# Altium schematic sheet USB2-HUB.SchDoc
size 297 x 209 mm; DocumentNumber: 5; SheetNumber: 5
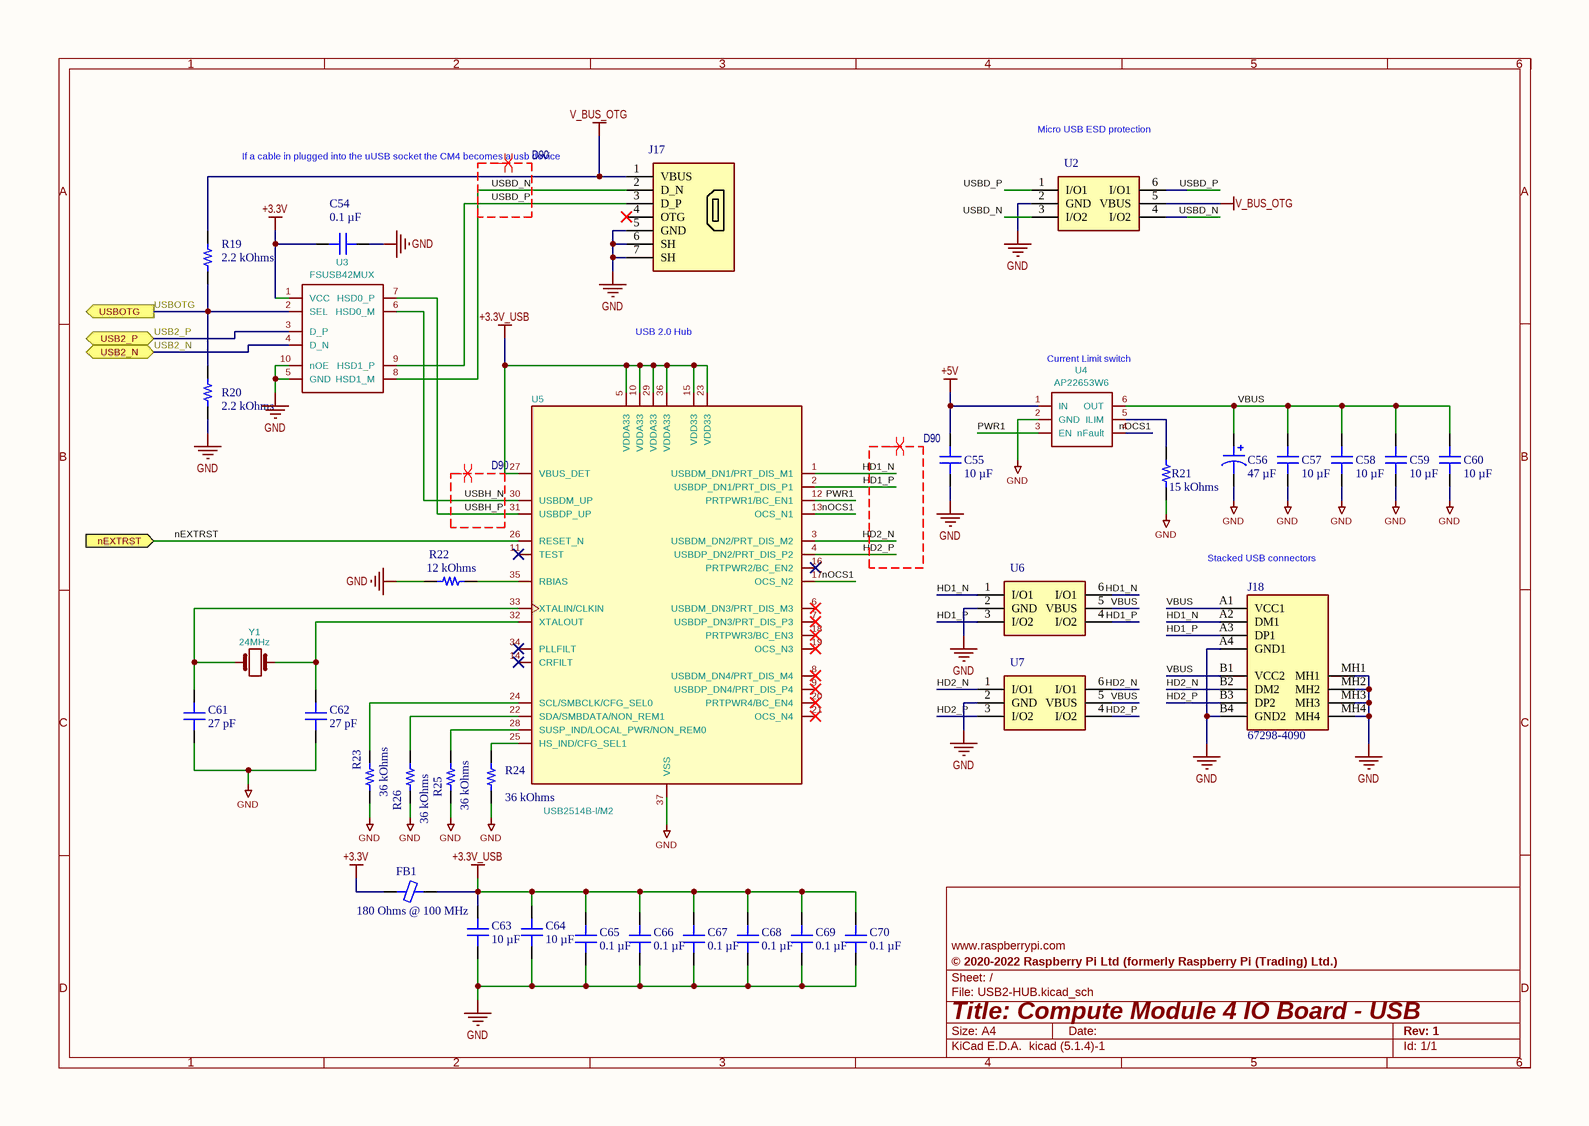
[diagram p0: USB2-HUB.SchDoc]

## Parts
C54  0.1 µF  [CAP 0603_1608]
C55  10 µF  [CAP 0805_2012]
C56  47 µF  [CAP POL 2917_7343]
C57  10 µF  [CAP 0805_2012]
C58  10 µF  [CAP 0805_2012]
C59  10 µF  [CAP 0805_2012]
C60  10 µF  [CAP 0805_2012]
C61  27 pF  [CAP 0603_1608]
C62  27 pF  [CAP 0603_1608]
C63  10 µF  [CAP 0805_2012]
C64  10 µF  [CAP 0805_2012]
C65  0.1 µF  [CAP 0603_1608]
C66  0.1 µF  [CAP 0603_1608]
C67  0.1 µF  [CAP 0603_1608]
C68  0.1 µF  [CAP 0603_1608]
C69  0.1 µF  [CAP 0603_1608]
C70  0.1 µF  [CAP 0603_1608]
FB1  180 Ohms @ 100 MHz  [FER 0603_1608]
J17  KLS1-2233B-B  [KLS1-2233B]  (value not drawn)
J18  67298-4090  [672984090]
R19  2.2 kOhms  [YAGEO RES 0603_1608]
R20  2.2 kOhms  [YAGEO RES 0603_1608]
R21  15 kOhms  [YAGEO RES 0603_1608]
R22  12 kOhms  [YAGEO RES 0603_1608]
R23  36 kOhms  [YAGEO RES 0603_1608]
R24  36 kOhms  [YAGEO RES 0603_1608]
R25  36 kOhms  [YAGEO RES 0603_1608]
R26  36 kOhms  [YAGEO RES 0603_1608]
U2  USBLC6-2SC6  [SOT95P280X145-6N]  (value not drawn)
U3  FSUSB42MUX  [MSOP-10_3x3mm_P0.5mm]
U4  AP22653W6  [SOT-23-6]
U5  USB2514B-I/M2  [QFN-36-1EP_6x6mm_P0.5mm_EP3.7x3.7mm]
U6  USBLC6-2SC6  [SOT95P280X145-6N]  (value not drawn)
U7  USBLC6-2SC6  [SOT95P280X145-6N]  (value not drawn)
Y1  24MHz  [Crystal_SMD_HC49-SD]

## Ports
nEXTRST (in, see GrandMini_v1[8B], CM4_GPIO[2C]), USB2_N (bidir, see GrandMini_v1[7B], CM4_HighSpeed[2A]), USB2_P (bidir, see GrandMini_v1[7B], CM4_HighSpeed[2A]), USBOTG (out, see GrandMini_v1[7B])

## Nets
+3.3V: C54.2 FB1.2 U3.1(VCC)
+3.3V_USB: C63.2 C64.2 C65.2 C66.2 C67.2 C68.2 C69.2 C70.2 FB1.1 U5.5(VDDA33) U5.10(VDDA33) U5.15(VDD33) U5.23(VDD33) U5.27(VBUS_DET) U5.29(VDDA33) U5.36(VDDA33)
+5V: C55.2 U4.1(IN)
GND: C54.1 C55.1 C56.2 C57.1 C58.1 C59.1 C60.1 C61.1 C62.1 C63.1 C64.1 C65.1 C66.1 C67.1 C68.1 C69.1 C70.1 J17.5(GND) J17.6(SH) J17.7(SH) J18.A4(GND1) J18.B4(GND2) J18.MH1 J18.MH2 J18.MH3 J18.MH4 R20.1 R21.1 R22.2 R23.2 R24.2 R25.2 R26.2 U2.2(GND) U3.5(GND) U3.10(nOE) U4.2(GND) U5.37(VSS) U6.2(GND) U7.2(GND)
V_BUS_OTG: J17.1(VBUS) R19.2 U2.5(VBUS)
HD1_N: J18.A2(DM1) U5.1(USBDM_DN1/PRT_DIS_M1) U6.1(I/O1) U6.6(I/O1)
HD1_P: J18.A3(DP1) U5.2(USBDP_DN1/PRT_DIS_P1) U6.3(I/O2) U6.4(I/O2)
HD2_N: J18.B2(DM2) U5.3(USBDM_DN2/PRT_DIS_M2) U7.1(I/O1) U7.6(I/O1)
HD2_P: J18.B3(DP2) U5.4(USBDP_DN2/PRT_DIS_P2) U7.3(I/O2) U7.4(I/O2)
nEXTRST: U5.26(RESET_N) ; port nEXTRST
nOCS1: U4.4(nFault) U5.13(OCS_N1) U5.17(OCS_N2)
PWR1: U4.3(EN) U5.12(PRTPWR1/BC_EN1)
USB2_N: U3.4(D_N) ; port USB2_N
USB2_P: U3.3(D_P) ; port USB2_P
USBD_N: J17.2(D_N) U2.3(I/O2) U2.4(I/O2) U3.8(HSD1_M)
USBD_P: J17.3(D_P) U2.1(I/O1) U2.6(I/O1) U3.9(HSD1_P)
USBH_N: U3.6(HSD0_M) U5.30(USBDM_UP)
USBH_P: U3.7(HSD0_P) U5.31(USBDP_UP)
USBOTG: R19.1 R20.2 U3.2(SEL) ; port USBOTG
VBUS: C56.1 C57.2 C58.2 C59.2 C60.2 J18.A1(VCC1) J18.B1(VCC2) U4.6(OUT) U6.5(VBUS) U7.5(VBUS)
NetC61_2: C61.2 U5.33(XTALIN/CLKIN) Y1.1
NetC62_2: C62.2 U5.32(XTALOUT) Y1.2
NetR21_2: R21.2 U4.5(ILIM)
NetR22_1: R22.1 U5.35(RBIAS)
NetR23_1: R23.1 U5.24(SCL/SMBCLK/CFG_SEL0)
NetR24_1: R24.1 U5.25(HS_IND/CFG_SEL1)
NetR25_1: R25.1 U5.28(SUSP_IND/LOCAL_PWR/NON_REM0)
NetR26_1: R26.1 U5.22(SDA/SMBDATA/NON_REM1)

Not connected (* = marked no-connect by the designer): J17 4(OTG)*; U5 6(USBDM_DN3/PRT_DIS_M3)* 7(USBDP_DN3/PRT_DIS_P3)* 8(USBDM_DN4/PRT_DIS_M4)* 9(USBDP_DN4/PRT_DIS_P4)* 11(TEST)* 14(CRFILT)* 16(PRTPWR2/BC_EN2)* 18(PRTPWR3/BC_EN3)* 19(OCS_N3)* 20(PRTPWR4/BC_EN4)* 21(OCS_N4)* 34(PLLFILT)*

## Layout directives
differential pair; differential pair class D90: HD1_N, HD1_P, HD2_N, HD2_P, USBD_N, USBD_P, USBH_N, USBH_P

## Notes on the sheet
- Micro USB ESD protection
- If a cable in plugged into the uUSB socket the CM4 becomes a usb device
- USB 2.0 Hub
- (near U4) Current Limit switch
- (near J18) Stacked USB connectors
- 1
- 2
- 3
- 4
- 5
- 6
- A
- B
- C
- www.raspberrypi.com <http://www.raspberrypi.com>
- D
- Title: Compute Module 4 IO Board - USB
- File: USB2-HUB.kicad_sch
- Sheet: /
- © 2020-2022 Raspberry Pi Ltd (formerly Raspberry Pi (Trading) Ltd.)
- KiCad E.D.A.  kicad (5.1.4)-1
- Size: A4
- Date:
- Rev: 1
- Id: 1/1

## Library data of the parts
C54 C65-C70 = CC0603KRX7R9BB104: CAP CER 0.1UF 50V X7R 0603; manufacturer: Yageo; Tolerance: ±10%; Value: 0.1 µF; Part Number: CC0603KRX7R9BB104; Applications: General Purpose; Capacitance: 0.1 µF; componentlink1description: Datasheet; componentlink1url: https://www.yageo.com/upload/media/product/productsearch/datasheet/mlcc/UPY-GPHC_X7R_6.3V-to-50V_18.pdf; componentlink2description: DigiKey Link; componentlink2url: https://www.digikey.com/en/products/detail/yageo/CC0603KRX7R9BB104/2103082; Device Package: 0603 (1608 Metric); lastupdated: 09.02.2024 20:10:21; Lifecycle Status: Active; Minimum Order: 1; Mounting Type: Surface Mount, MLCC; Operating Temperature: -55°C ~ 125°C; Package / Case: 0603 (1608 Metric); packaging: TapeAndReel; partid: 9506; Part Status: Active; price: 0.01; series: CC; Size / Dimension: 0.063" L x 0.031" W (1.60mm x 0.80mm); Supplier 1: DigiKey; Supplier Part Number 1: 311-1344-1-ND; Temperature Coefficient: X7R; Thickness (Max): 0.035" (0.90mm); Voltage - Rated: 50V
C55 C57-C60 C63 C64 = CC0805KKX5R8BB106: CAP CER 10UF 25V X5R 0805; manufacturer: Yageo; Tolerance: ±10%; Value: 10 µF; Part Number: CC0805KKX5R8BB106; Applications: General Purpose; Capacitance: 10 µF; componentlink1description: Datasheet; componentlink1url: https://www.yageo.com/upload/media/product/productsearch/datasheet/mlcc/UPY-GPHC_X5R_4V-to-50V_25.pdf; componentlink2description: DigiKey Link; componentlink2url: https://www.digikey.com/en/products/detail/yageo/CC0805KKX5R8BB106/5195275; Device Package: 0805 (2012 Metric); lastupdated: 09.02.2024 20:15:28; Lifecycle Status: Active; Minimum Order: 1; Mounting Type: Surface Mount, MLCC; Operating Temperature: -55°C ~ 85°C; Package / Case: 0805 (2012 Metric); packaging: TapeAndReel; partid: 16151; Part Status: Active; price: 0.06; series: CC; Size / Dimension: 0.079" L x 0.049" W (2.00mm x 1.25mm); Supplier 1: DigiKey; Supplier Part Number 1: 311-1869-1-ND; Temperature Coefficient: X5R; Thickness (Max): 0.057" (1.45mm); Voltage - Rated: 25V
C56 = T491X476K035AT: CAP TANT 47UF 10% 35V 2917; manufacturer: KEMET; Manufacturer Size Code: X; ESR (Equivalent Series Resistance): 600mOhm; Lifetime @ Temp.: 2000 Hrs @ 125°C; Type: Molded; Value: 47 µF; Part Number: T491X476K035AT; Capacitance: 47 µF; componentlink1description: Datasheet; componentlink1url: https://api.kemet.com/component-edge/download/datasheet/T491X476K035AT.pdf; componentlink2description: DigiKey Link; componentlink2url: https://www.digikey.com/en/products/detail/kemet/T491X476K035AT/818681; Device Package: 2917 (7343 Metric); Features: General Purpose; Height - Seated (Max): 0.169" (4.30mm); lastupdated: 03.06.2024 19:30:20; Lifecycle Status: Active; Minimum Order: 1; Mounting Type: Surface Mount; Operating Temperature: -55°C ~ 125°C; Package / Case: 2917 (7343 Metric); packaging: TapeAndReel; partid: 3168; Part Status: Active; price: 1.10; series: T491; Size / Dimension: 0.287" L x 0.169" W (7.30mm x 4.30mm); Supplier 1: DigiKey; Supplier Part Number 1: 399-3821-1-ND; Tolerance: ±10%; Voltage - Rated: 35 V
C61 C62 = CC0603GRNPO0BN270: CAP CER 27PF 100V C0G/NPO 0603; manufacturer: Yageo; Temperature Coefficient: C0G, NP0; Tolerance: ±2%; Value: 27 pF; Part Number: CC0603GRNPO0BN270; Applications: General Purpose; Capacitance: 27 pF; componentlink1description: Datasheet; componentlink1url: //media.digikey.com/pdf/Data%20Sheets/Yageo%20PDFs/CCseries_mlcc_2002.pdf; componentlink2description: DigiKey Link; componentlink2url: https://www.digikey.com/en/products/detail/yageo/CC0603GRNPO0BN270/5883527; Device Package: 0603 (1608 Metric); lastupdated: 09.02.2024 20:10:23; Lifecycle Status: Active; Minimum Order: 1; Mounting Type: Surface Mount, MLCC; Operating Temperature: -55°C ~ 125°C; Package / Case: 0603 (1608 Metric); packaging: TapeAndReel; partid: 39171; Part Status: Active; price: 0.01; series: CC; Size / Dimension: 0.063" L x 0.031" W (1.60mm x 0.80mm); Supplier 1: DigiKey; Supplier Part Number 1: 311-3910-1-ND; Thickness (Max): 0.035" (0.90mm); Voltage - Rated: 100V
FB1 = BLM18PG181SN1D: FERRITE BEAD 180 OHM 0603 1LN; Manufacturer: Murata Electronics; Current Rating (Max): 1.5A; DC Resistance (DCR) (Max): 90mOhm; Filter Type: Power Line; Number of Lines: 1; Part Number: BLM18PG181SN1D; ComponentLink1Description: Datasheet; ComponentLink1URL: https://www.murata.com/en-us/products/productdata/8796738650142/ENFA0003.pdf; ComponentLink2Description: DigiKey Link; ComponentLink2URL: https://www.digikey.com/en/products/detail/murata-electronics/BLM18PG181SN1D/1634634; Device Package: 0603 (1608 Metric); Height (Max): 0.037" (0.95mm); Impedance @ Frequency: 180 Ohms @ 100 MHz; LastUpdated: 03.06.2024 19:51:52; Lifecycle Status: Active; Minimum Order: 1; Mounting Type: Surface Mount; Operating Temperature: -55°C ~ 125°C; Package / Case: 0603 (1608 Metric); Packaging: TapeAndReel; PartId: 858; Part Status: Active; Price: 0.02; Series: EMIFIL®, BLM18; Size / Dimension: 0.063" L x 0.032" W (1.60mm x 0.80mm); Supplier 1: DigiKey; Supplier Part Number 1: 490-5263-1-ND; Value: 180 Ohms @ 100 MHz
J17 = KLS1-2233B-B: Connector, Micro USB 2.0 Vertical; Manufacturer: KLS; Datasheet Link: https://static.chipdip.ru/lib/747/DOC042747020.pdf; Part Number: KLS1-2233B-B; Manufacturer 2: GCT; Part Number 2: USB3130
J18 = 67298-4090: Connector; Manufacturer_Name: Molex; Datasheet Link: https://www.molex.com/pdm_docs/sd/672984090_sd.pdf; Height: 15mm; Manufacturer_Part_Number: 67298-4090; Mouser Part Number: 538-67298-4090; Mouser Price/Stock: https://www.mouser.co.uk/ProductDetail/Molex/67298-4090?qs=Lu3apKW7jUgjgQ9KehYn5g%3D%3D
R19 R20 = RC0603FR-072K2L: RES 2.2K OHM 1% 1/10W 0603; Manufacturer: Yageo; Power (Watts): 0.1W, 1/10W; Temperature Coefficient: ±100ppm/°C; Value: 2.2 kOhms; Part Number: RC0603FR-072K2L; ComponentLink1Description: Datasheet; ComponentLink1URL: https://www.yageo.com/upload/media/product/productsearch/datasheet/rchip/PYu-RC_Group_51_RoHS_L_10.pdf; ComponentLink2Description: DigiKey Link; ComponentLink2URL: https://www.digikey.com/en/products/detail/yageo/RC0603FR-072K2L/727016; Composition: Thick Film; Device Package: 0603 (1608 Metric); Features: Moisture Resistant; Height - Seated (Max): 0.022" (0.55mm); LastUpdated: 25.07.2024 9:19:17; Lifecycle Status: Active; Minimum Order: 1; Number of Terminations: 2; Operating Temperature: -55°C ~ 155°C; Package / Case: 0603 (1608 Metric); Packaging: CutTape; PartId: 23950; Part Status: Active; Price: 0.01; Resistance: 2.2 kOhms; Series: RC_L; Size / Dimension: 0.063" L x 0.031" W (1.60mm x 0.80mm); Supplier 1: DigiKey; Supplier Part Number 1: 311-2.20KHRCT-ND; Supplier Device Package: 0603; Tolerance: ±1%
R21 = RC0603FR-0715KL: RES 15K OHM 1% 1/10W 0603; Manufacturer: Yageo; Power (Watts): 0.1W, 1/10W; Temperature Coefficient: ±100ppm/°C; Value: 15 kOhms; Part Number: RC0603FR-0715KL; ComponentLink1Description: Datasheet; ComponentLink1URL: https://www.yageo.com/upload/media/product/productsearch/datasheet/rchip/PYu-RC_Group_51_RoHS_L_10.pdf; ComponentLink2Description: DigiKey Link; ComponentLink2URL: https://www.digikey.com/en/products/detail/yageo/RC0603FR-0715KL/726953; Composition: Thick Film; Device Package: 0603 (1608 Metric); Features: Moisture Resistant; Height - Seated (Max): 0.022" (0.55mm); LastUpdated: 25.07.2024 9:19:17; Lifecycle Status: Active; Minimum Order: 1; Number of Terminations: 2; Operating Temperature: -55°C ~ 155°C; Package / Case: 0603 (1608 Metric); Packaging: CutTape; PartId: 23955; Part Status: Active; Price: 0.01; Resistance: 15 kOhms; Series: RC_L; Size / Dimension: 0.063" L x 0.031" W (1.60mm x 0.80mm); Supplier 1: DigiKey; Supplier Part Number 1: 311-15.0KHRCT-ND; Supplier Device Package: 0603; Tolerance: ±1%
R22 = RC0603FR-0712KL: RES 12K OHM 1% 1/10W 0603; Manufacturer: Yageo; Power (Watts): 0.1W, 1/10W; Temperature Coefficient: ±100ppm/°C; Value: 12 kOhms; Part Number: RC0603FR-0712KL; ComponentLink1Description: Datasheet; ComponentLink1URL: https://www.yageo.com/upload/media/product/productsearch/datasheet/rchip/PYu-RC_Group_51_RoHS_L_10.pdf; ComponentLink2Description: DigiKey Link; ComponentLink2URL: https://www.digikey.com/en/products/detail/yageo/RC0603FR-0712KL/726913; Composition: Thick Film; Device Package: 0603 (1608 Metric); Features: Moisture Resistant; Height - Seated (Max): 0.022" (0.55mm); LastUpdated: 25.07.2024 9:19:21; Lifecycle Status: Active; Minimum Order: 1; Number of Terminations: 2; Operating Temperature: -55°C ~ 155°C; Package / Case: 0603 (1608 Metric); Packaging: CutTape; PartId: 19007; Part Status: Active; Price: 0.01; Resistance: 12 kOhms; Series: RC_L; Size / Dimension: 0.063" L x 0.031" W (1.60mm x 0.80mm); Supplier 1: DigiKey; Supplier Part Number 1: 311-12.0KHRCT-ND; Supplier Device Package: 0603; Tolerance: ±1%
R23-R26 = RC0603FR-0736KL: RES 36K OHM 1% 1/10W 0603; Manufacturer: Yageo; Power (Watts): 0.1W, 1/10W; Temperature Coefficient: ±100ppm/°C; Value: 36 kOhms; Part Number: RC0603FR-0736KL; ComponentLink1Description: Datasheet; ComponentLink1URL: https://www.yageo.com/upload/media/product/productsearch/datasheet/rchip/PYu-RC_Group_51_RoHS_L_10.pdf; ComponentLink2Description: DigiKey Link; ComponentLink2URL: https://www.digikey.com/en/products/detail/yageo/RC0603FR-0736KL/727179; Composition: Thick Film; Device Package: 0603 (1608 Metric); Features: Moisture Resistant; Height - Seated (Max): 0.022" (0.55mm); LastUpdated: 25.07.2024 9:19:21; Lifecycle Status: Active; Minimum Order: 1; Number of Terminations: 2; Operating Temperature: -55°C ~ 155°C; Package / Case: 0603 (1608 Metric); Packaging: CutTape; PartId: 19090; Part Status: Active; Price: 0.01; Resistance: 36 kOhms; Series: RC_L; Size / Dimension: 0.063" L x 0.031" W (1.60mm x 0.80mm); Supplier 1: DigiKey; Supplier Part Number 1: 311-36.0KHRCT-ND; Supplier Device Package: 0603; Tolerance: ±1%
U2 U6 U7 = USBLC6-2SC6: Integrated Circuit; Manufacturer_Name: STMicroelectronics; Datasheet Link: http://www.st.com/st-web-ui/static/active/en/resource/technical/document/datasheet/CD00050750.pdf; Height: 1.45mm; Manufacturer_Part_Number: USBLC6-2SC6; Mouser Part Number: 511-USBLC6-2SC6; Mouser Price/Stock: https://www.mouser.co.uk/ProductDetail/STMicroelectronics/USBLC6-2SC6?qs=po45yt2pPpu%2FhNIlwQdTlg%3D%3D; Arrow Part Number: USBLC6-2SC6; Arrow Price/Stock: https://www.arrow.com/en/products/usblc6-2sc6/stmicroelectronics?region=nac
U3 = FSUSB42MX: Part Description: USB Switch IC 1 Channel 10-MSOP; Field4: Farnell; Field5: 2564479; Field7: Onsemi; Field6: FSUSB42MUX; Value: FSUSB42MUX; Footprint: Package_SO:MSOP-10_3x3mm_P0.5mm
U4 = AP2553W6: Part Description: Power Switch/Driver 1:1 P-Channel 2.1A SOT-23-6; Field4: Digikey; Field5: 31-AP22653W6-7CT-ND; Field7: Diodes; Field6: AP22653W6; Value: AP22653W6; Footprint: Package_TO_SOT_SMD:SOT-23-6
U5 = USB2514B_Bi: Part Description: USB Hub Controller USB Interface 36-SQFN (6x6); Field4: Farnell; Field5: 2775060; Field7: Microchip; Field8: UICC00931; Field6: USB2514B-I/M2; Value: USB2514B-I/M2; Footprint: Package_DFN_QFN:QFN-36-1EP_6x6mm_P0.5mm_EP3.7x3.7mm
Y1 = Crystal: Part Description: 24MHz Crystal 18pf 30ppm 30ppm; Field4: Farnell; Field5: 2508493; Field7: AEL; Field6: X24M000000S128; Value: 24MHz; Footprint: Crystal:Crystal_SMD_HC49-SD